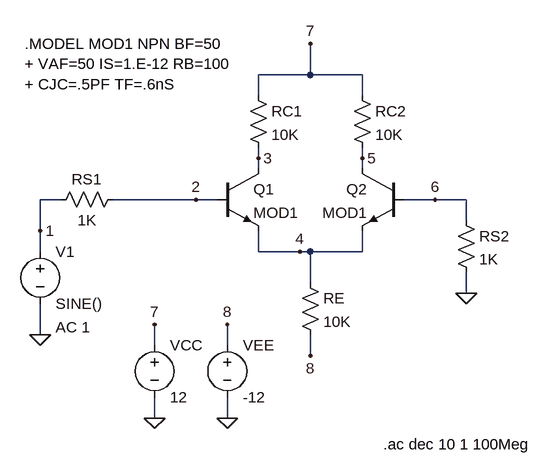
[diagram p0: schematic Fig_10-1_Differential_Pair.asc]
Fig_10-1_Differential_Pair.asc, the LTspice schematic file:
Version 4
SHEET 1 880 680
WIRE 240 -96 240 -144
WIRE 240 -96 160 -96
WIRE 320 -96 240 -96
WIRE 160 -64 160 -96
WIRE 320 -64 320 -96
WIRE 160 32 160 16
WIRE 320 32 320 16
WIRE 160 48 160 32
WIRE 320 48 320 32
WIRE -144 96 -176 96
WIRE 64 96 -64 96
WIRE 96 96 64 96
WIRE 432 96 384 96
WIRE 480 96 432 96
WIRE 480 128 480 96
WIRE -176 144 -176 96
WIRE -176 176 -176 144
WIRE 160 176 160 144
WIRE 224 176 160 176
WIRE 240 176 224 176
WIRE 320 176 320 144
WIRE 320 176 240 176
WIRE 240 224 240 176
WIRE 480 240 480 208
WIRE -176 304 -176 256
WIRE 0 320 0 288
WIRE 112 320 112 288
WIRE 240 336 240 304
WIRE 0 432 0 400
WIRE 112 432 112 400
FLAG -176 304 0
FLAG 112 432 0
FLAG 480 240 0
FLAG 0 432 0
FLAG 0 288 7
FLAG -176 144 1
FLAG 64 96 2
FLAG 160 32 3
FLAG 224 176 4
FLAG 320 32 5
FLAG 432 96 6
FLAG 112 288 8
FLAG 240 -144 7
FLAG 240 336 8
SYMBOL voltage -176 160 R0
WINDOW 123 24 132 Left 2
WINDOW 39 0 0 Left 2
SYMATTR Value2 AC 1
SYMATTR InstName V1
SYMATTR Value SINE()
SYMBOL voltage 112 304 R0
WINDOW 123 0 0 Left 2
WINDOW 39 0 0 Left 2
SYMATTR InstName VEE
SYMATTR Value -12
SYMBOL voltage 0 304 R0
SYMATTR InstName VCC
SYMATTR Value 12
SYMBOL res 144 -80 R0
SYMATTR InstName RC1
SYMATTR Value 10K
SYMBOL res 304 -80 R0
SYMATTR InstName RC2
SYMATTR Value 10K
SYMBOL res 464 112 R0
SYMATTR InstName RS2
SYMATTR Value 1K
SYMBOL res 224 208 R0
SYMATTR InstName RE
SYMATTR Value 10K
SYMBOL res -48 80 R90
WINDOW 0 0 56 VBottom 2
WINDOW 3 32 56 VTop 2
SYMATTR InstName RS1
SYMATTR Value 1K
SYMBOL npn 96 48 R0
SYMATTR InstName Q1
SYMATTR Value MOD1
SYMBOL npn 384 48 M0
SYMATTR InstName Q2
SYMATTR Value MOD1
TEXT 352 472 Left 2 !.ac dec 10 1 100Meg
TEXT -200 -144 Left 2 !.MODEL MOD1 NPN BF=50\n+ VAF=50 IS=1.E-12 RB=100\n+ CJC=.5PF TF=.6nS

The netlist it stands for:
* Fig_10-1_Differential_Pair.asc
V1 1 0 SINE() AC 1
VEE 8 0 -12
VCC 7 0 12
RC1 7 3 10K
RC2 7 5 10K
RS2 6 0 1K
RE 4 8 10K
RS1 2 1 1K
Q1 3 2 4 0 MOD1
Q2 5 6 4 0 MOD1
.model NPN NPN
.model PNP PNP
.lib standard.bjt
.ac dec 10 1 100Meg
.MODEL MOD1 NPN BF=50
+ VAF=50 IS=1.E-12 RB=100
+ CJC=.5PF TF=.6nS
.backanno
.end